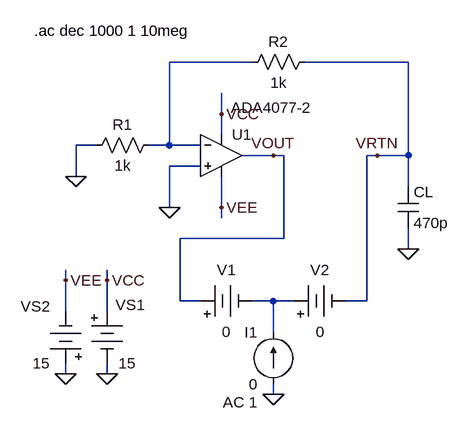
[diagram p0: schematic fig-03-01-30.asc]
fig-03-01-30.asc, the LTspice schematic file:
Version 4
SHEET 1 964 680
WIRE 256 32 128 32
WIRE 496 32 336 32
WIRE 208 112 208 80
WIRE 208 144 208 112
WIRE 16 160 -16 160
WIRE 128 160 128 32
WIRE 128 160 96 160
WIRE 176 160 128 160
WIRE 288 176 240 176
WIRE 304 176 288 176
WIRE 448 176 432 176
WIRE 496 176 496 32
WIRE 496 176 448 176
WIRE 176 192 128 192
WIRE -16 208 -16 160
WIRE 496 224 496 176
WIRE 128 256 128 192
WIRE 208 256 208 208
WIRE 208 272 208 256
WIRE 304 304 304 176
WIRE 304 304 144 304
WIRE 496 320 496 288
WIRE -32 368 -32 352
WIRE 32 368 32 352
WIRE 144 400 144 304
WIRE 176 400 144 400
WIRE 288 400 256 400
WIRE 320 400 288 400
WIRE 432 400 432 176
WIRE 432 400 400 400
WIRE -32 416 -32 368
WIRE 32 416 32 368
WIRE 288 448 288 400
WIRE -32 512 -32 496
WIRE 32 512 32 496
WIRE 288 544 288 528
FLAG 128 256 0
FLAG -16 208 0
FLAG -32 512 0
FLAG 32 512 0
FLAG -32 368 VEE
FLAG 32 368 VCC
FLAG 208 112 VCC
FLAG 208 256 VEE
FLAG 496 320 0
FLAG 288 176 VOUT
FLAG 448 176 VRTN
FLAG 288 544 0
SYMBOL res 352 16 R90
WINDOW 0 0 56 VBottom 2
WINDOW 3 32 56 VTop 2
SYMATTR InstName R2
SYMATTR Value 1k
SYMBOL Misc\\battery 32 400 R0
WINDOW 0 13 6 Left 2
WINDOW 3 18 96 Left 2
SYMATTR InstName VS1
SYMATTR Value 15
SYMBOL Misc\\battery -32 512 R180
WINDOW 0 24 104 Left 2
WINDOW 3 24 16 Left 2
SYMATTR InstName VS2
SYMATTR Value 15
SYMBOL Opamps\\ADA4077-2 208 112 R0
WINDOW 3 15 -10 Left 2
SYMATTR InstName U1
SYMBOL res 112 144 R90
WINDOW 0 0 56 VBottom 2
WINDOW 3 32 56 VTop 2
SYMATTR InstName R1
SYMATTR Value 1k
SYMBOL cap 480 224 R0
SYMATTR InstName CL
SYMATTR Value 470p
SYMBOL current 288 528 R180
WINDOW 0 24 80 Left 2
WINDOW 3 24 0 Left 2
WINDOW 123 24 -28 Left 2
WINDOW 39 0 0 Left 0
SYMATTR InstName I1
SYMATTR Value 0
SYMATTR Value2 AC 1
SYMBOL Misc\\battery 160 400 R270
WINDOW 0 32 56 VTop 2
WINDOW 3 -32 56 VBottom 2
SYMATTR InstName V1
SYMATTR Value 0
SYMBOL Misc\\battery 304 400 R270
WINDOW 0 32 56 VTop 2
WINDOW 3 -32 56 VBottom 2
SYMATTR InstName V2
SYMATTR Value 0
TEXT -80 -16 Left 2 !.ac dec 1000 1 10meg

The netlist it stands for:
* fig-03-01-30.asc
R2 VRTN N001 1k
VS1 VCC 0 15
VS2 0 VEE 15
XU1 0 N001 VCC VEE VOUT ADA4077-2  ; pins In+ In- V+ V- OUT
R1 N001 0 1k
CL VRTN 0 470p
I1 0 N002 0 AC 1
V1 VOUT N002 0
V2 N002 VRTN 0
.ac dec 1000 1 10meg
.backanno
.end